# EAGLE design 7seg (EAGLE 5.10)
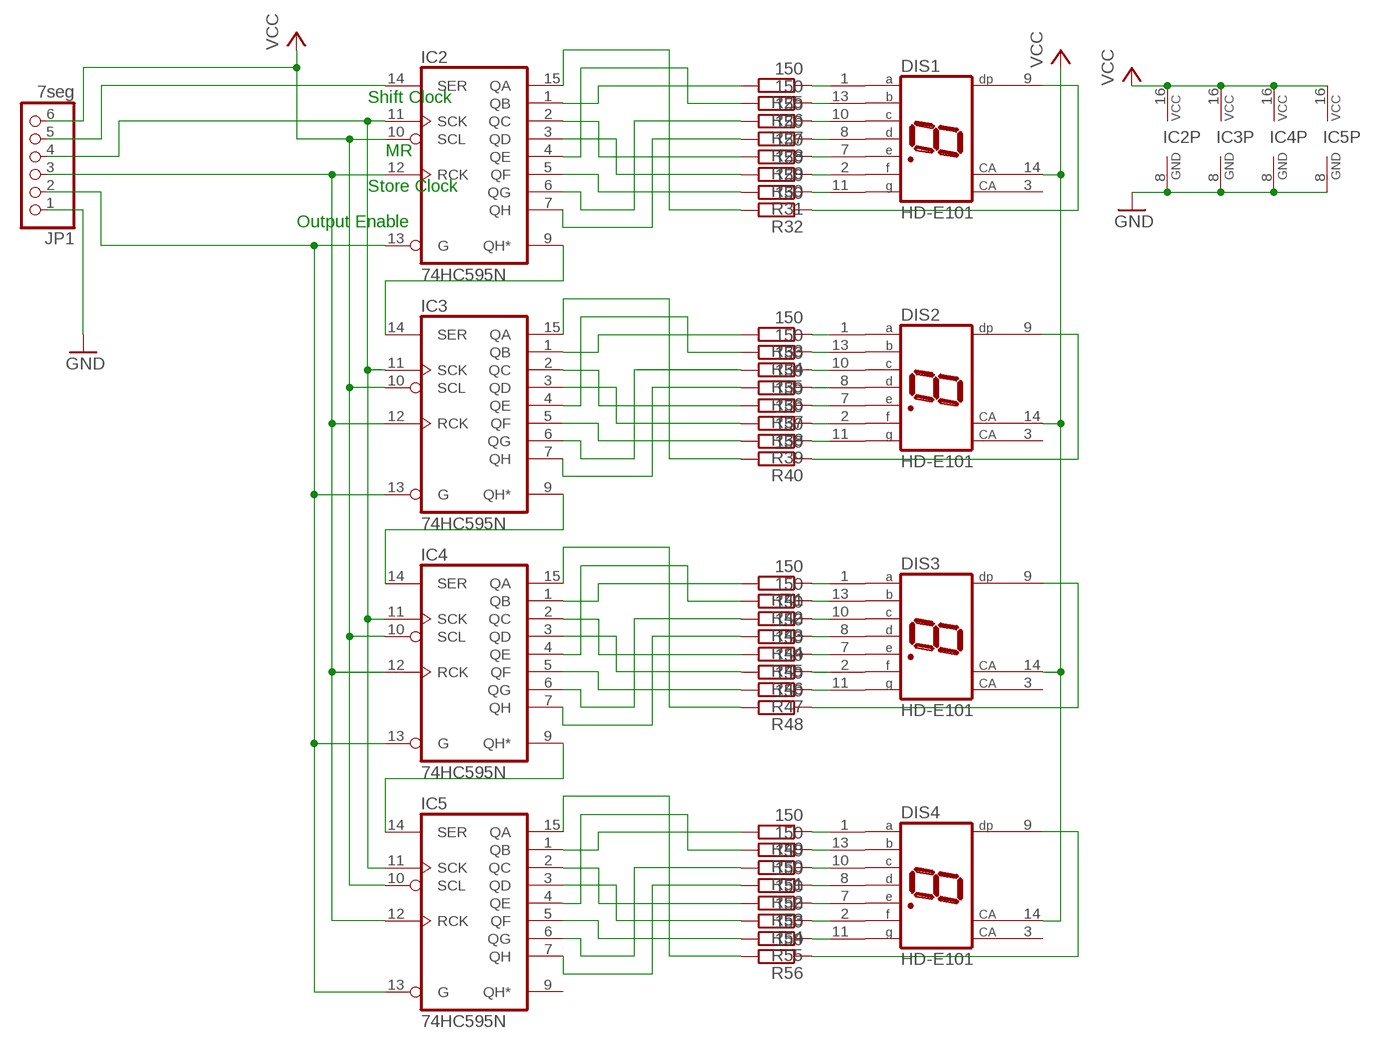
[diagram p0: schematic, sheet 1]

## Parts
DIS1  HD-E101  [HDSP-I]
DIS2  HD-E101  [HDSP-I]
DIS3  HD-E101  [HDSP-I]
DIS4  HD-E101  [HDSP-I]
IC2  74HC595N  [DIL16]
IC3  74HC595N  [DIL16]
IC4  74HC595N  [DIL16]
IC5  74HC595N  [DIL16]
JP1  7seg  PINHD-1X6/90  [1X06/90]
R25  150  R-EU_R0603  [R0603]
R26  150  R-EU_R0603  [R0603]
R27  150  R-EU_R0603  [R0603]
R28  150  R-EU_R0603  [R0603]
R29  150  R-EU_R0603  [R0603]
R30  150  R-EU_R0603  [R0603]
R31  150  R-EU_R0603  [R0603]
R32  150  R-EU_R0603  [R0603]
R33  150  R-EU_R0603  [R0603]
R34  150  R-EU_R0603  [R0603]
R35  150  R-EU_R0603  [R0603]
R36  150  R-EU_R0603  [R0603]
R37  150  R-EU_R0603  [R0603]
R38  150  R-EU_R0603  [R0603]
R39  150  R-EU_R0603  [R0603]
R40  150  R-EU_R0603  [R0603]
R41  150  R-EU_R0603  [R0603]
R42  150  R-EU_R0603  [R0603]
R43  150  R-EU_R0603  [R0603]
R44  150  R-EU_R0603  [R0603]
R45  150  R-EU_R0603  [R0603]
R46  150  R-EU_R0603  [R0603]
R47  150  R-EU_R0603  [R0603]
R48  150  R-EU_R0603  [R0603]
R49  150  R-EU_R0603  [R0603]
R50  150  R-EU_R0603  [R0603]
R51  150  R-EU_R0603  [R0603]
R52  150  R-EU_R0603  [R0603]
R53  150  R-EU_R0603  [R0603]
R54  150  R-EU_R0603  [R0603]
R55  150  R-EU_R0603  [R0603]
R56  150  R-EU_R0603  [R0603]

## Nets
GND: IC2.8(GND) IC3.8(GND) IC4.8(GND) IC5.8(GND) JP1.1
N$1: IC2.14(SER) JP1.5
N$2: IC3.1(QB) R33.2
N$4: IC3.2(QC) R37.2
N$5: IC3.3(QD) R38.2
N$6: IC3.4(QE) R34.2
N$7: IC3.5(QF) R39.2
N$8: IC3.6(QG) R35.2
N$9: IC3.7(QH) R36.2
N$10: IC3.15(QA) R40.2
N$11: IC4.1(QB) R41.2
N$12: IC4.2(QC) R45.2
N$13: IC4.3(QD) R46.2
N$14: IC4.4(QE) R42.2
N$15: IC4.5(QF) R47.2
N$16: IC4.6(QG) R43.2
N$17: IC4.7(QH) R44.2
N$18: IC4.15(QA) R48.2
N$19: IC2.1(QB) R25.2
N$20: IC2.2(QC) R29.2
N$21: IC2.3(QD) R30.2
N$22: IC2.4(QE) R26.2
N$23: IC2.5(QF) R31.2
N$24: IC2.6(QG) R27.2
N$25: IC2.7(QH) R28.2
N$26: IC2.15(QA) R32.2
N$27: IC5.1(QB) R49.2
N$28: IC5.2(QC) R53.2
N$29: IC5.3(QD) R54.2
N$30: IC5.4(QE) R50.2
N$31: IC5.5(QF) R55.2
N$32: IC5.6(QG) R51.2
N$33: IC5.7(QH) R52.2
N$34: IC5.15(QA) R56.2
N$51: DIS1.1(A) R25.1
N$58: DIS1.13(B) R26.1
N$59: DIS1.10(C) R27.1
N$60: DIS1.8(D) R28.1
N$61: DIS1.7(E) R29.1
N$62: DIS1.2(F) R30.1
N$63: DIS1.11(G) R31.1
N$72: DIS2.1(A) R33.1
N$73: DIS2.13(B) R34.1
N$74: DIS2.10(C) R35.1
N$75: DIS2.8(D) R36.1
N$76: DIS2.7(E) R37.1
N$77: DIS2.2(F) R38.1
N$78: DIS2.11(G) R39.1
N$87: DIS3.1(A) R41.1
N$88: DIS3.13(B) R42.1
N$89: DIS3.10(C) R43.1
N$90: DIS3.8(D) R44.1
N$91: DIS3.7(E) R45.1
N$92: DIS3.2(F) R46.1
N$93: DIS3.11(G) R47.1
N$102: DIS4.1(A) R49.1
N$103: DIS4.13(B) R50.1
N$104: DIS4.10(C) R51.1
N$105: DIS4.8(D) R52.1
N$106: DIS4.7(E) R53.1
N$107: DIS4.2(F) R54.1
N$108: DIS4.11(G) R55.1
N$109: DIS1.9(DP) R32.1
N$110: DIS2.9(DP) R40.1
N$111: DIS3.9(DP) R48.1
N$112: DIS4.9(DP) R56.1
N$115: IC2.9(QH*) IC3.14(SER)
N$116: IC3.9(QH*) IC4.14(SER)
N$117: IC4.9(QH*) IC5.14(SER)
N$124: IC2.12(RCK) IC3.12(RCK) IC4.12(RCK) IC5.12(RCK) JP1.3
N$125: IC2.13(G) IC3.13(G) IC4.13(G) IC5.13(G) JP1.2
N$146: IC2.11(SCK) IC3.11(SCK) IC4.11(SCK) IC5.11(SCK) JP1.4
VCC: DIS1.14(CA) DIS2.14(CA) DIS3.14(CA) DIS4.14(CA) IC2.10(SCL) IC2.16(VCC) IC3.10(SCL) IC3.16(VCC) IC4.10(SCL) IC4.16(VCC) IC5.10(SCL) IC5.16(VCC) JP1.6
Unconnected: DIS1.3(CA) DIS2.3(CA) DIS3.3(CA) DIS4.3(CA) IC5.9(QH*)

## Notes on the sheet
- Shift Clock
- MR
- Store Clock
- Output Enable

## Library data of the parts
DIS1-DIS4 = display-hp:HD-E101: LED DISPLAY 1-character 7 segment, decimal point right
IC2-IC5 = 74xx-eu:74*595: 8-bit SHIFT REGISTER, output latch
JP1 = pinhead:PINHD-1X6: PIN HEADER
R25-R56 = rcl:R-EU_: RESISTOR, European symbol

## Board
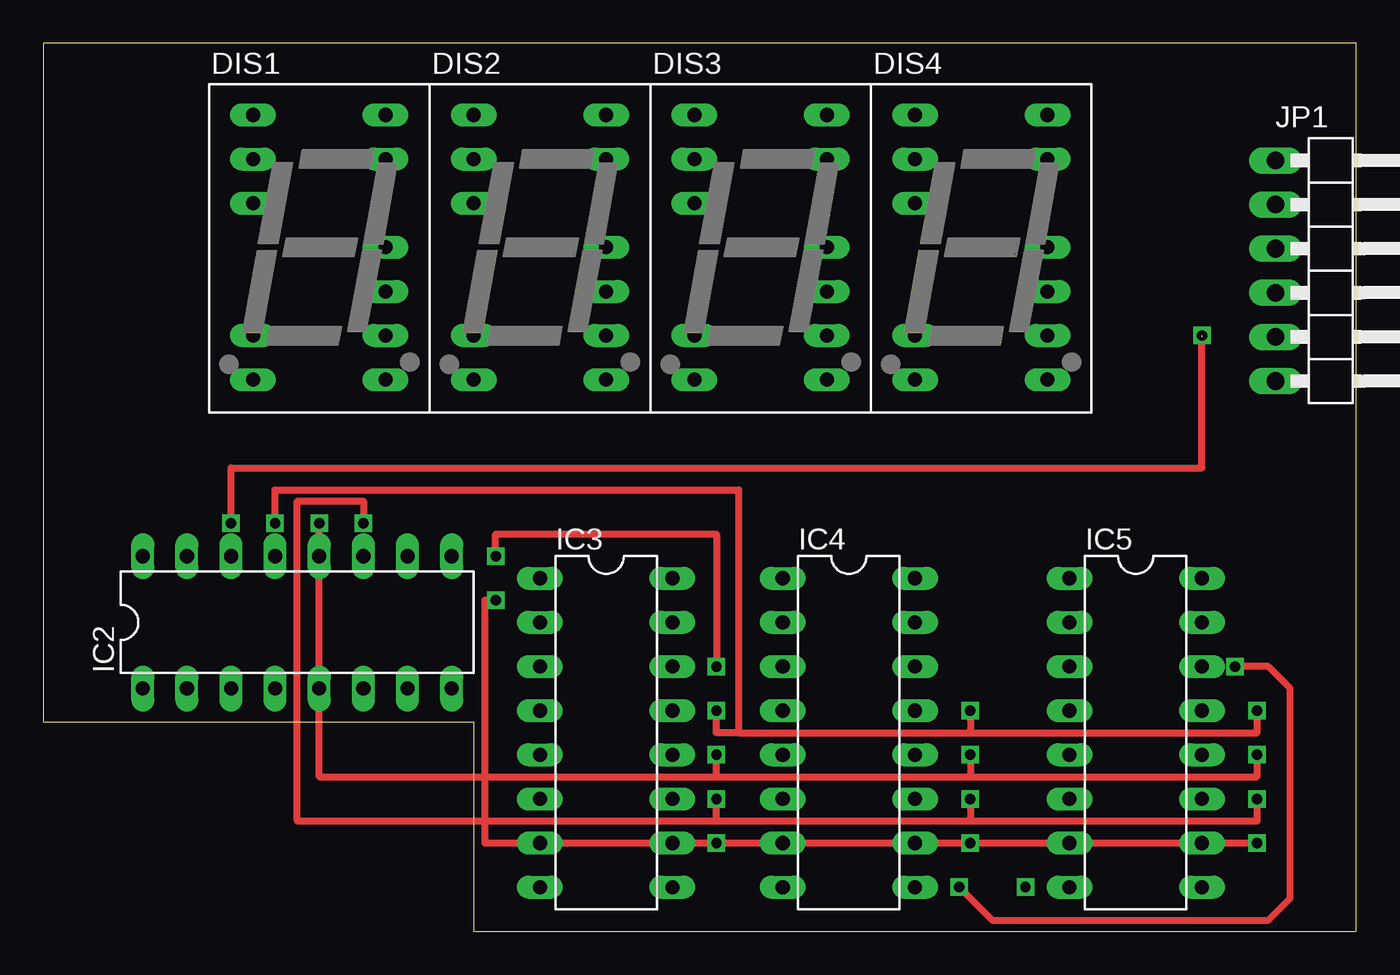
[diagram p1: board, top side]
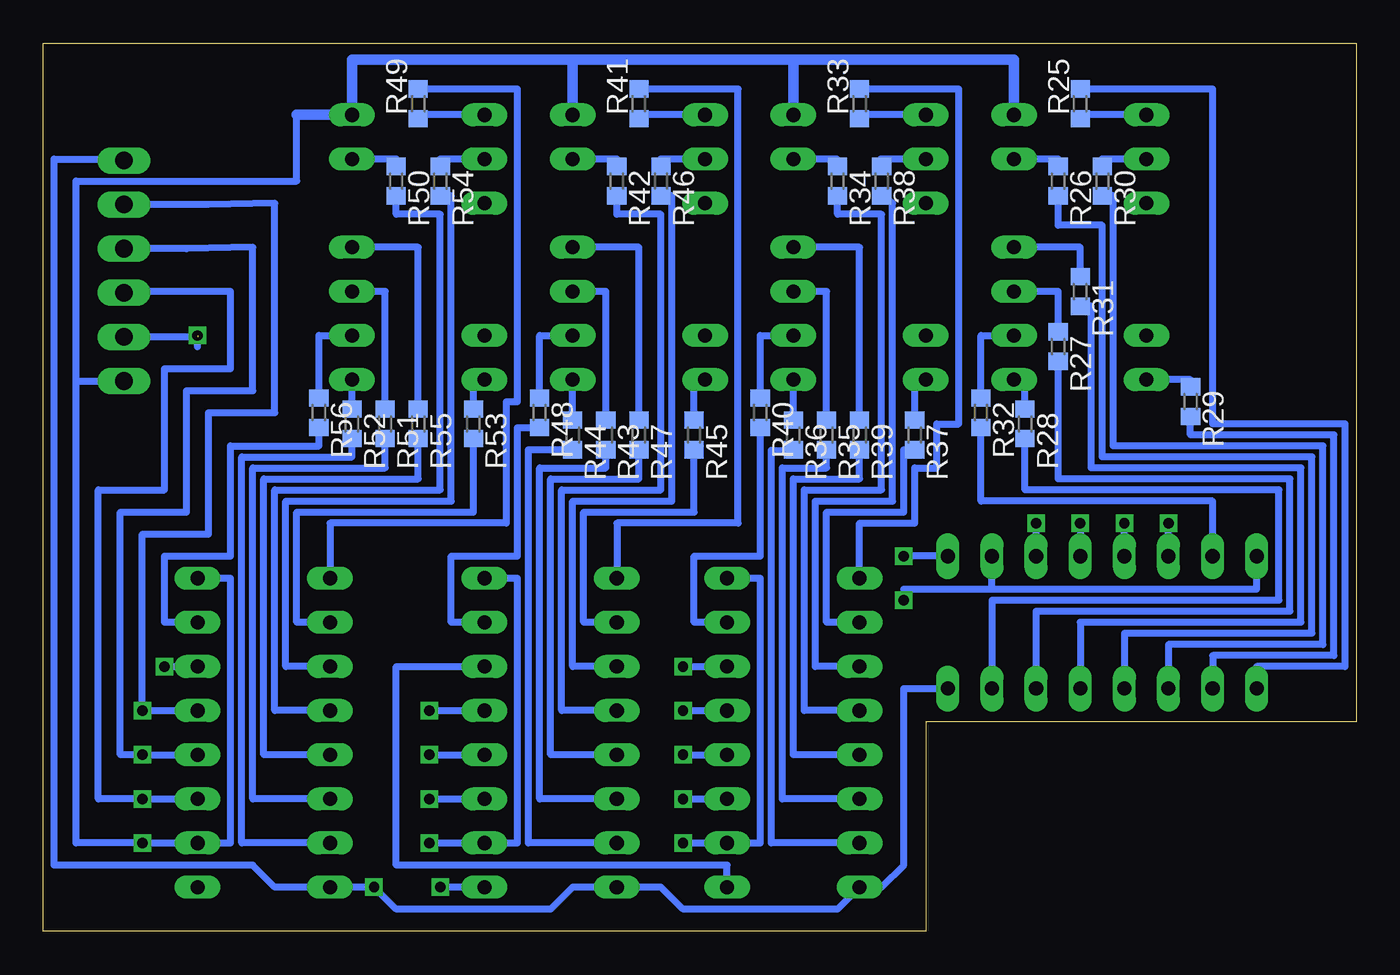
[diagram p2: board, bottom side, seen from below]

Size 75.55 x 51.1 mm. Coordinates in mm from the lower left corner, seen from the top.
Outline: 0,12.06 24.77,12.06 24.77,0 75.55,0 75.55,51.1 0,51.1 0,12.06
Copper layers (1*16): Top 0.035mm / dielectric 1.5mm / Bottom 0.035mm
Design rules "default": minimum track width 10mil, minimum drill 24mil, track to track 8mil, track to pad 8mil, pad to pad 8mil, via to via 8mil, smd to smd 8mil, copper to edge 40mil, drill to drill 8mil, minimum pad ring 10mil, minimum via ring 8mil, stop-mask expansion 4mil, vias tented up to drill 0mil, thermal gap 10mil

### Footprints (pad centres in the part's own frame; a part is rotated, then mirrored left to right if it is on the bottom)
HDSP-I = drill 0.813 long: 1 -3.81,7.62; 2 -3.81,5.08; 3 -3.81,2.54; 6 -3.81,-5.08; 7 -3.81,-7.62; 8 3.81,-7.62; 9 3.81,-5.08; 10 3.81,-2.54; 11 3.81,0; 13 3.81,5.08; 14 3.81,7.62
DIL16 = drill 0.813 long: 1 -8.89,-3.81; 2 -6.35,-3.81; 3 -3.81,-3.81; 4 -1.27,-3.81; 5 1.27,-3.81; 6 3.81,-3.81; 7 6.35,-3.81; 8 8.89,-3.81; 9 8.89,3.81; 10 6.35,3.81; 11 3.81,3.81; 12 1.27,3.81; 13 -1.27,3.81; 14 -3.81,3.81; 15 -6.35,3.81; 16 -8.89,3.81
1X06/90 = drill 1.016 long: 1 -6.35,-3.81; 2 -3.81,-3.81; 3 -1.27,-3.81; 4 1.27,-3.81; 5 3.81,-3.81; 6 6.35,-3.81
R0603 = smd 1 x 1.1: 1 -0.85,0; 2 0.85,0

### Placement (x,y rotation side)
DIS1  15.88,39.37 0 top
DIS2  28.57,39.37 0 top
DIS3  41.27,39.37 0 top
DIS4  53.98,39.37 0 top
IC2  14.61,17.78 0 top
IC3  32.38,11.43 270 top
IC4  46.35,11.43 270 top
IC5  62.87,11.43 270 top
JP1  74.72,38.02 270 top
R25  15.88,47.62 90 bottom
R26  17.14,43.18 270 bottom
R27  17.14,33.66 270 bottom
R28  19.05,29.21 270 bottom
R29  9.53,30.48 270 bottom
R30  14.61,43.18 270 bottom
R31  15.88,36.83 270 bottom
R32  21.59,29.84 270 bottom
R33  28.57,47.62 90 bottom
R34  29.84,43.18 270 bottom
R35  30.48,28.57 270 bottom
R36  32.38,28.57 270 bottom
R37  25.4,28.57 270 bottom
R38  27.3,43.18 270 bottom
R39  28.57,28.57 270 bottom
R40  34.29,29.84 270 bottom
R41  41.27,47.62 90 bottom
R42  42.55,43.18 270 bottom
R43  43.18,28.57 270 bottom
R44  45.09,28.57 270 bottom
R45  38.1,28.57 270 bottom
R46  40.01,43.18 270 bottom
R47  41.27,28.57 270 bottom
R48  46.99,29.84 270 bottom
R49  53.98,47.62 90 bottom
R50  55.24,43.18 270 bottom
R51  55.88,29.21 270 bottom
R52  57.78,29.21 270 bottom
R53  50.8,29.21 270 bottom
R54  52.7,43.18 270 bottom
R55  53.98,29.21 270 bottom
R56  59.69,29.84 270 bottom

### Tracks (layer width: path | path; a pad name or v marks a point on that pad's centre or on a via)
GND  (via drill 0.6)
  Bottom 0.406: IC2.8 26.04,13.97 26.04,3.81 27.3,2.54 IC3.8 29.84,1.27 38.73,1.27 40.01,2.54 IC4.8 45.09,2.54 46.35,1.27 55.24,1.27 v56.52,2.54 IC5.8 62.23,2.54 63.5,3.81 74.93,3.81 74.93,44.45 70.99,44.45 JP1.1
N$1  (via drill 0.6)  (1 unrouted)
  Top 0.406: v10.79,23.5 10.79,26.67 66.67,26.67 v66.67,34.29
  Bottom 0.406: IC2.14 v10.79,23.5 | JP1.5 66.67,34.21 66.67,33.66
N$2
  Bottom 0.406: IC3.1 28.57,23.5 25.4,23.5 25.4,26.67 24.13,26.67 24.13,29.21 22.86,29.21 22.86,48.48 R33.2
N$4
  Bottom 0.406: 25.4,27.99 R37.2 26.04,27.73 26.04,24.13 30.48,24.13 30.48,17.78 IC3.2
N$5
  Bottom 0.406: R38.2 26.67,41.91 26.67,24.77 31.11,24.77 31.11,15.24 IC3.3
N$6
  Bottom 0.406: 29.84,42.59 R34.2 29.84,41.27 27.3,41.27 27.3,25.4 31.75,25.4 31.75,12.7 IC3.4
N$7
  Bottom 0.406: 28.57,27.99 R39.2 28.57,26.04 32.38,26.04 32.38,10.16 IC3.5
N$8
  Bottom 0.406: 30.48,27.99 R35.2 30.48,26.67 33.02,26.67 33.02,7.62 IC3.6
N$9
  Bottom 0.406: 32.38,27.99 R36.2 33.66,27.67 33.66,5.08 IC3.7
N$10
  Bottom 0.406: R40.2 34.29,21.59 38.1,21.59 38.1,17.78 IC3.15
N$11
  Bottom 0.406: R41.2 35.56,48.48 35.56,23.5 42.55,23.5 IC4.1
N$12
  Bottom 0.406: R45.2 38.1,24.13 44.45,24.13 44.45,17.78 IC4.2
N$13
  Bottom 0.406: R46.2 39.37,42.33 39.37,24.77 45.09,24.77 45.09,15.24 IC4.3
N$14
  Bottom 0.406: R42.2 42.55,41.27 40.01,41.27 40.01,25.4 45.72,25.4 45.72,12.7 IC4.4
N$15
  Bottom 0.406: R47.2 41.27,26.04 46.35,26.04 46.35,10.16 IC4.5
N$16
  Bottom 0.406: R43.2 43.18,26.67 46.99,26.67 46.99,7.62 IC4.6
N$17
  Bottom 0.406: R44.2 47.62,27.73 47.62,5.08 IC4.7
N$18
  Bottom 0.406: R48.2 48.26,29 48.26,21.59 52.07,21.59 52.07,17.78 IC4.15
N$19
  Bottom 0.406: R25.2 8.26,48.48 8.26,29.21 0.64,29.21 0.64,15.24 5.71,15.24 IC2.1
N$20
  Bottom 0.406: R29.2 9.53,28.57 1.27,28.57 1.27,15.88 8.26,15.88 IC2.2
N$21
  Bottom 0.406: R30.2 13.97,42.33 13.97,27.94 1.91,27.94 1.91,16.51 10.79,16.51 IC2.3
N$22
  Bottom 0.406: R26.2 17.14,40.64 14.61,40.64 14.61,27.3 2.54,27.3 2.54,17.14 13.34,17.14 IC2.4
N$23
  Bottom 0.406: R31.2 15.24,35.98 15.24,26.67 3.17,26.67 3.17,17.78 15.88,17.78 IC2.5
N$24
  Bottom 0.406: R27.2 17.14,26.04 3.81,26.04 3.81,18.41 18.41,18.41 IC2.6
N$25
  Bottom 0.406: IC2.7 20.95,19.05 4.45,19.05 4.45,25.4 19.05,25.4 R28.2
N$26
  Bottom 0.406: R32.2 21.59,24.77 8.26,24.77 IC2.15
N$27
  Bottom 0.406: R49.2 48.26,48.48 48.26,30.48 48.9,30.48 48.9,23.5 59.05,23.5 IC5.1
N$28
  Bottom 0.406: R53.2 50.8,24.13 60.96,24.13 60.96,17.78 IC5.2
N$29
  Bottom 0.406: R54.2 52.07,42.33 52.07,24.77 61.59,24.77 61.59,15.24 IC5.3
N$30
  Bottom 0.406: R50.2 55.24,41.27 52.7,41.27 52.7,25.4 62.23,25.4 62.23,12.7 IC5.4
N$31
  Bottom 0.406: R55.2 53.98,26.04 62.87,26.04 62.87,10.16 IC5.5
N$32
  Bottom 0.406: R51.2 55.88,26.67 63.5,26.67 63.5,7.62 IC5.6
N$33
  Bottom 0.406: R52.2 57.78,27.3 64.14,27.3 64.14,5.08 IC5.7
N$34
  Bottom 0.406: R56.2 59.69,27.94 64.77,27.94 64.77,21.59 68.58,21.59 68.58,17.78 IC5.15
N$51
  Bottom 0.406: DIS1.1 15.88,46.99 R25.1
N$58
  Bottom 0.406: DIS1.13 17.14,44.45 R26.1
N$59
  Bottom 0.406: DIS1.10 17.14,36.83 R27.1
N$60
  Bottom 0.406: DIS1.8 19.05,31.75 R28.1
N$61
  Bottom 0.406: DIS1.7 9.53,31.75 R29.1
N$62
  Bottom 0.406: DIS1.2 14.61,44.45 R30.1
N$63
  Bottom 0.406: DIS1.11 15.88,39.37 R31.1
N$72
  Bottom 0.406: DIS2.1 28.54,46.99 R33.1
N$73
  Bottom 0.406: DIS2.13 29.89,44.45 R34.1
N$74
  Bottom 0.406: DIS2.10 30.48,36.83 R35.1
N$75
  Bottom 0.406: R36.1 DIS2.8
N$76
  Bottom 0.406: DIS2.7 25.4,31.75 R37.1
N$77
  Bottom 0.406: DIS2.2 27.34,44.45 R38.1
N$78
  Bottom 0.406: DIS2.11 28.57,39.37 R39.1
N$87
  Bottom 0.406: DIS3.1 41.27,46.99 R41.1
N$88
  Bottom 0.406: DIS3.13 42.55,44.45 R42.1
N$89
  Bottom 0.406: DIS3.10 43.18,36.83 R43.1
N$90
  Bottom 0.406: R44.1 DIS3.8
N$91
  Bottom 0.406: DIS3.7 38.1,31.75 R45.1
N$92
  Bottom 0.406: DIS3.2 40.01,44.45 R46.1
N$93
  Bottom 0.406: DIS3.11 41.27,39.37 R47.1
N$102
  Bottom 0.406: DIS4.1 53.98,46.99 R49.1
N$103
  Bottom 0.406: DIS4.13 55.24,44.45 R50.1
N$104
  Bottom 0.406: DIS4.10 55.88,36.83 R51.1
N$105
  Bottom 0.406: R52.1 DIS4.8
N$106
  Bottom 0.406: DIS4.7 50.8,31.75 R53.1
N$107
  Bottom 0.406: DIS4.2 52.7,44.45 R54.1
N$108
  Bottom 0.406: DIS4.11 53.98,39.37 R55.1
N$109
  Bottom 0.406: DIS1.9 21.59,34.29 R32.1
N$110
  Bottom 0.406: DIS2.9 34.29,34.29 R40.1
N$111
  Bottom 0.406: DIS3.9 46.99,34.29 R48.1
N$112
  Bottom 0.406: DIS4.9 59.69,34.29 R56.1
N$115  (via drill 0.6)
  Top 0.406: v26.04,21.59 26.04,22.86 38.73,22.86 v38.73,15.24
  Bottom 0.406: IC2.9 v26.04,21.59 | v38.73,15.24 IC3.14
N$116
  Bottom 0.406: IC4.14 55.24,15.24 55.24,3.81 36.2,3.81 IC3.9
N$117  (via drill 0.6 pad 0.61)
  Top 0.406: v68.58,15.24 70.48,15.24 71.75,13.97 71.75,1.91 70.48,0.64 54.61,0.64 v52.7,2.54
  Bottom 0.406: v68.58,15.24 IC5.14 | IC4.9 v52.7,2.54
N$124  (via drill 0.6)
  Top 0.406: 38.73,8.89 53.34,8.89 | v53.34,10.16 53.34,8.89 | 53.34,8.89 69.85,8.89 v69.85,10.16 | v15.88,23.5 15.88,8.89 38.73,8.89 | 38.73,8.89 v38.73,10.16
  Bottom 0.406: v38.73,10.16 IC3.12 | v53.34,10.16 IC4.12 | IC5.12 v69.85,10.16 71.12,10.16 71.12,24.13 67.31,24.13 67.31,31.11 63.5,31.11 63.5,39.37 67.31,39.29 JP1.3 | v15.88,23.5 IC2.12
N$125  (via drill 0.6)
  Top 0.406: 40.01,11.43 38.73,11.43 v38.73,12.7 | 40.01,11.43 53.34,11.43 | v53.34,12.7 53.34,11.43 | 53.34,11.43 69.85,11.43 v69.85,12.7 | v13.34,23.5 13.34,25.4 40.01,25.4 40.01,11.43
  Bottom 0.406: v38.73,12.7 IC3.13 | v53.34,12.7 IC4.13 | IC5.13 v69.85,12.7 69.85,22.86 66.04,22.86 66.04,29.84 62.23,29.84 62.23,41.91 66.04,41.83 JP1.2 | IC2.13 v13.34,23.5
N$146  (via drill 0.6)
  Top 0.406: 38.73,6.35 53.34,6.35 | v53.34,7.62 53.34,6.35 | 53.34,6.35 69.85,6.35 v69.85,7.62 | v18.41,23.5 18.41,24.77 14.61,24.77 14.61,6.35 38.73,6.35 | 38.73,6.35 v38.73,7.62
  Bottom 0.406: v38.73,7.62 IC3.11 | v53.34,7.62 IC4.11 | IC5.11 v69.85,7.62 72.39,7.62 72.39,25.4 68.58,25.4 68.58,32.38 64.77,32.38 64.77,36.83 70.91,36.83 JP1.4 | v18.41,23.5 IC2.11
VCC  (via drill 0.6)
  Top 0.406: v26.04,19.05 25.4,19.05 25.4,5.08 v38.73,5.08 v53.34,5.08 v69.85,5.08
  Bottom 0.406: IC2.16 5.71,19.68 20.95,19.68 | 20.95,19.68 IC2.10 | IC3.16 34.29,20.32 34.29,5.08 IC3.10 v38.73,5.08 | IC4.16 48.26,20.32 48.26,5.08 IC4.10 v53.34,5.08 | IC5.16 64.77,20.32 64.77,5.08 IC5.10 v69.85,5.08 73.66,5.08 73.66,31.67 | 20.95,19.68 26.04,19.68 v26.04,19.05 | 73.66,31.67 73.66,43.18 60.96,43.18 60.96,46.99 | 73.66,31.67 JP1.6
  Bottom 0.61: DIS1.14 19.68,50.16 32.38,50.16 | 32.38,50.16 DIS2.14 | 45.09,50.16 32.38,50.16 | 45.09,50.16 DIS3.14 | 45.09,50.16 57.78,50.16 DIS4.14 60.96,46.99